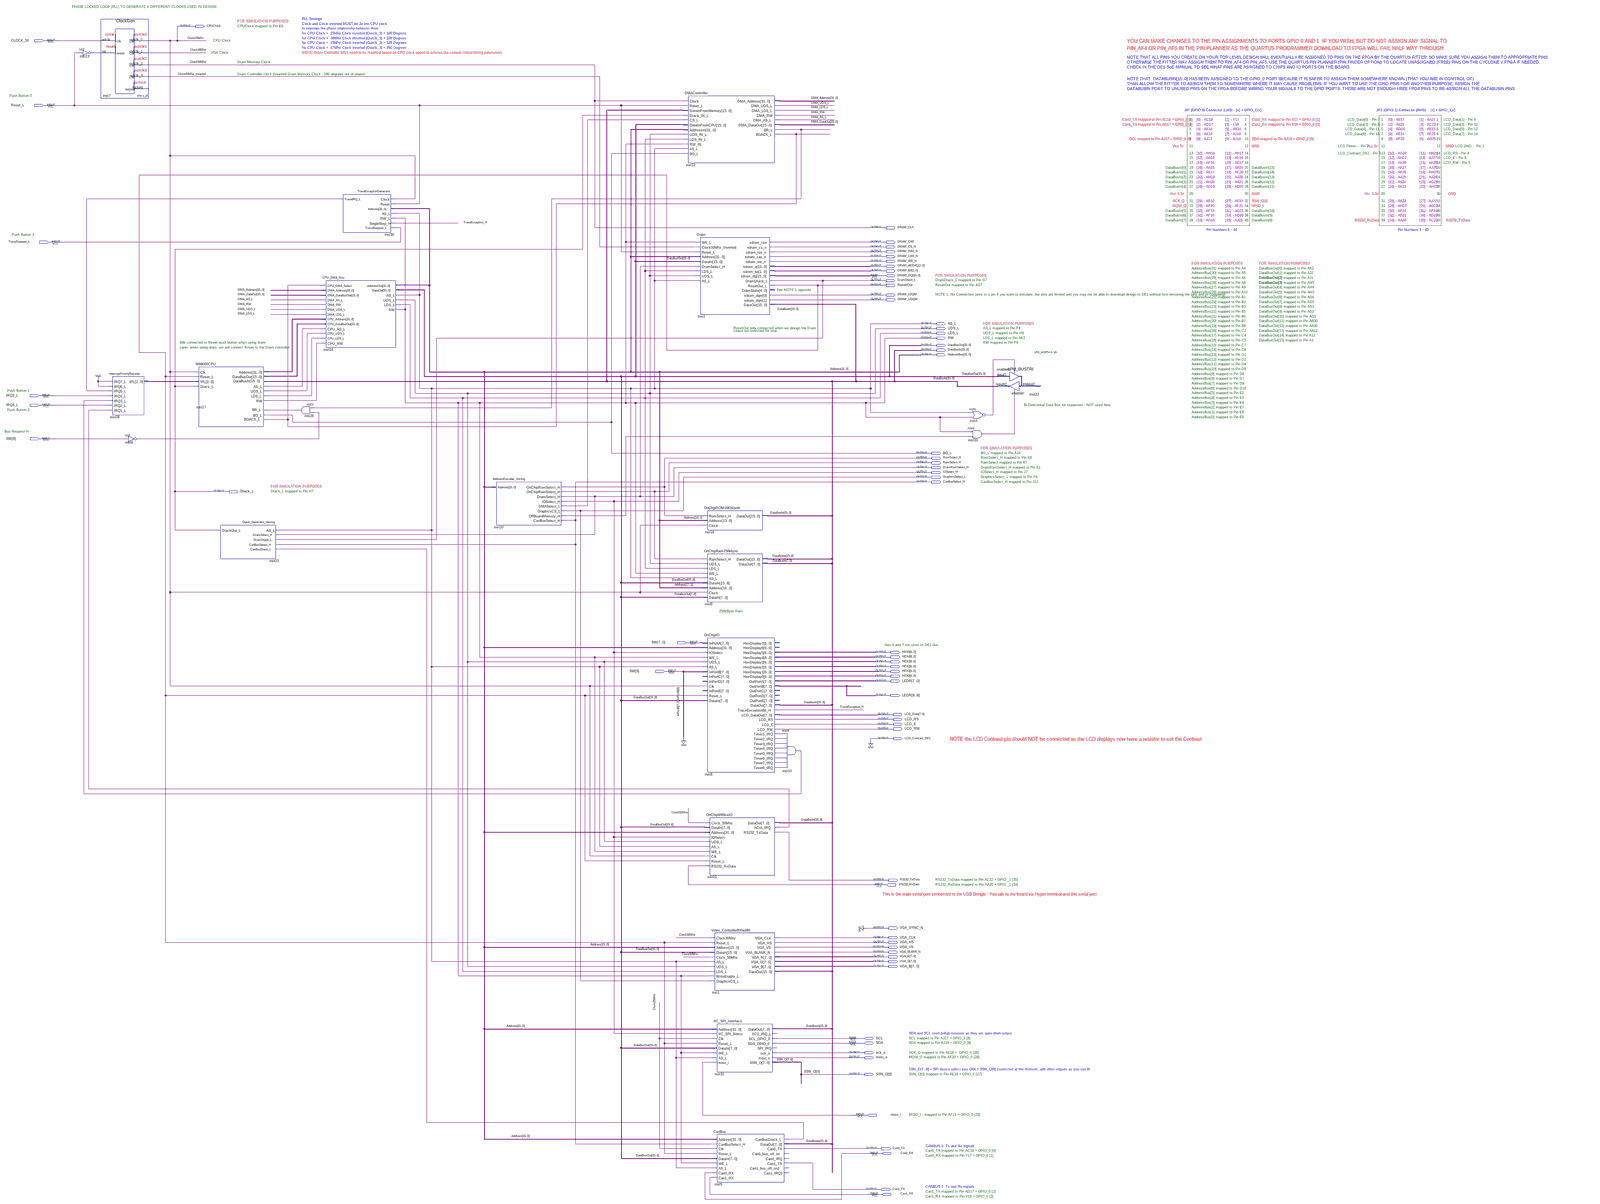
[diagram p0: schematic sheet, whole]
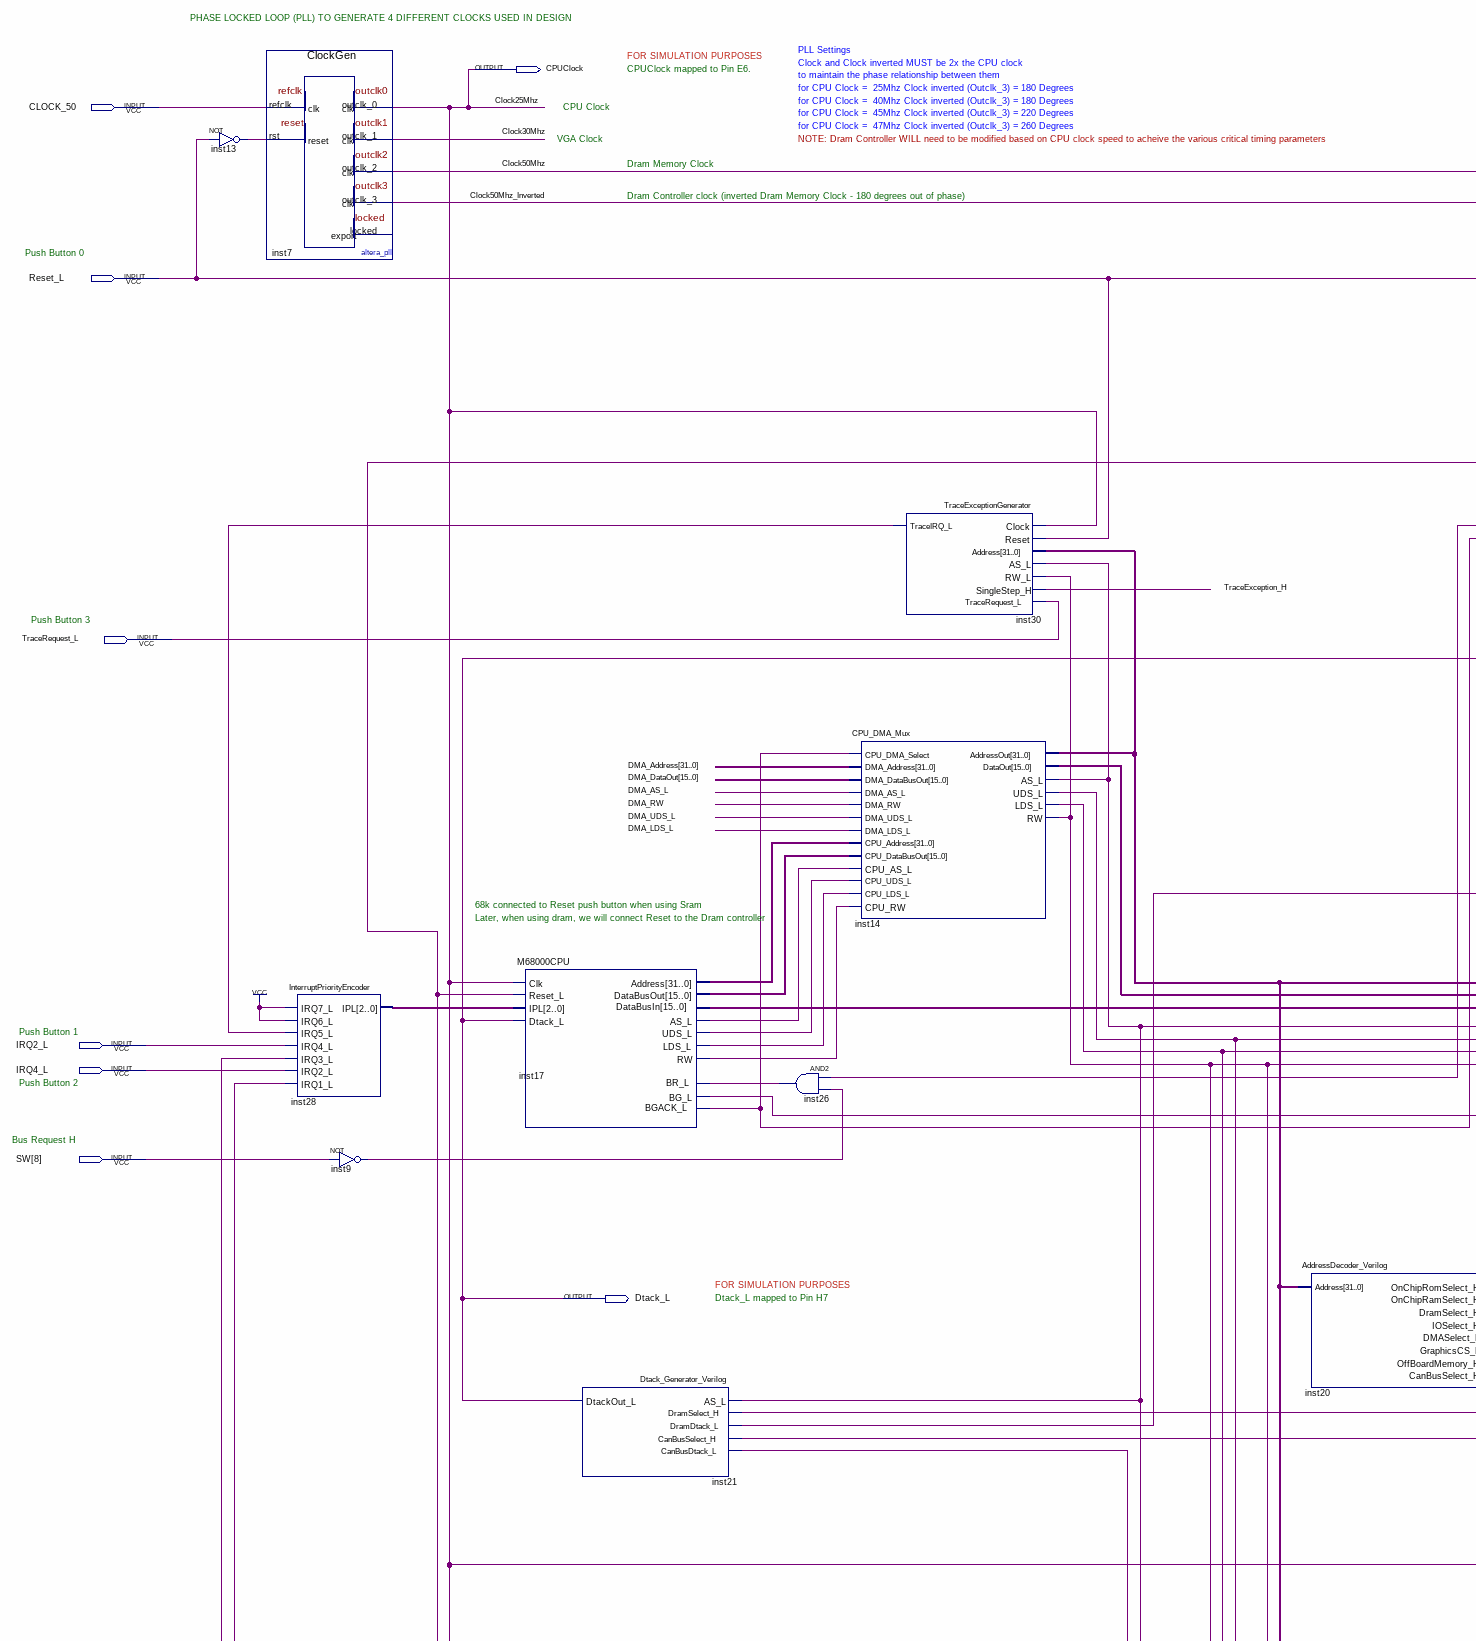
[diagram p1: schematic sheet, upper left part]
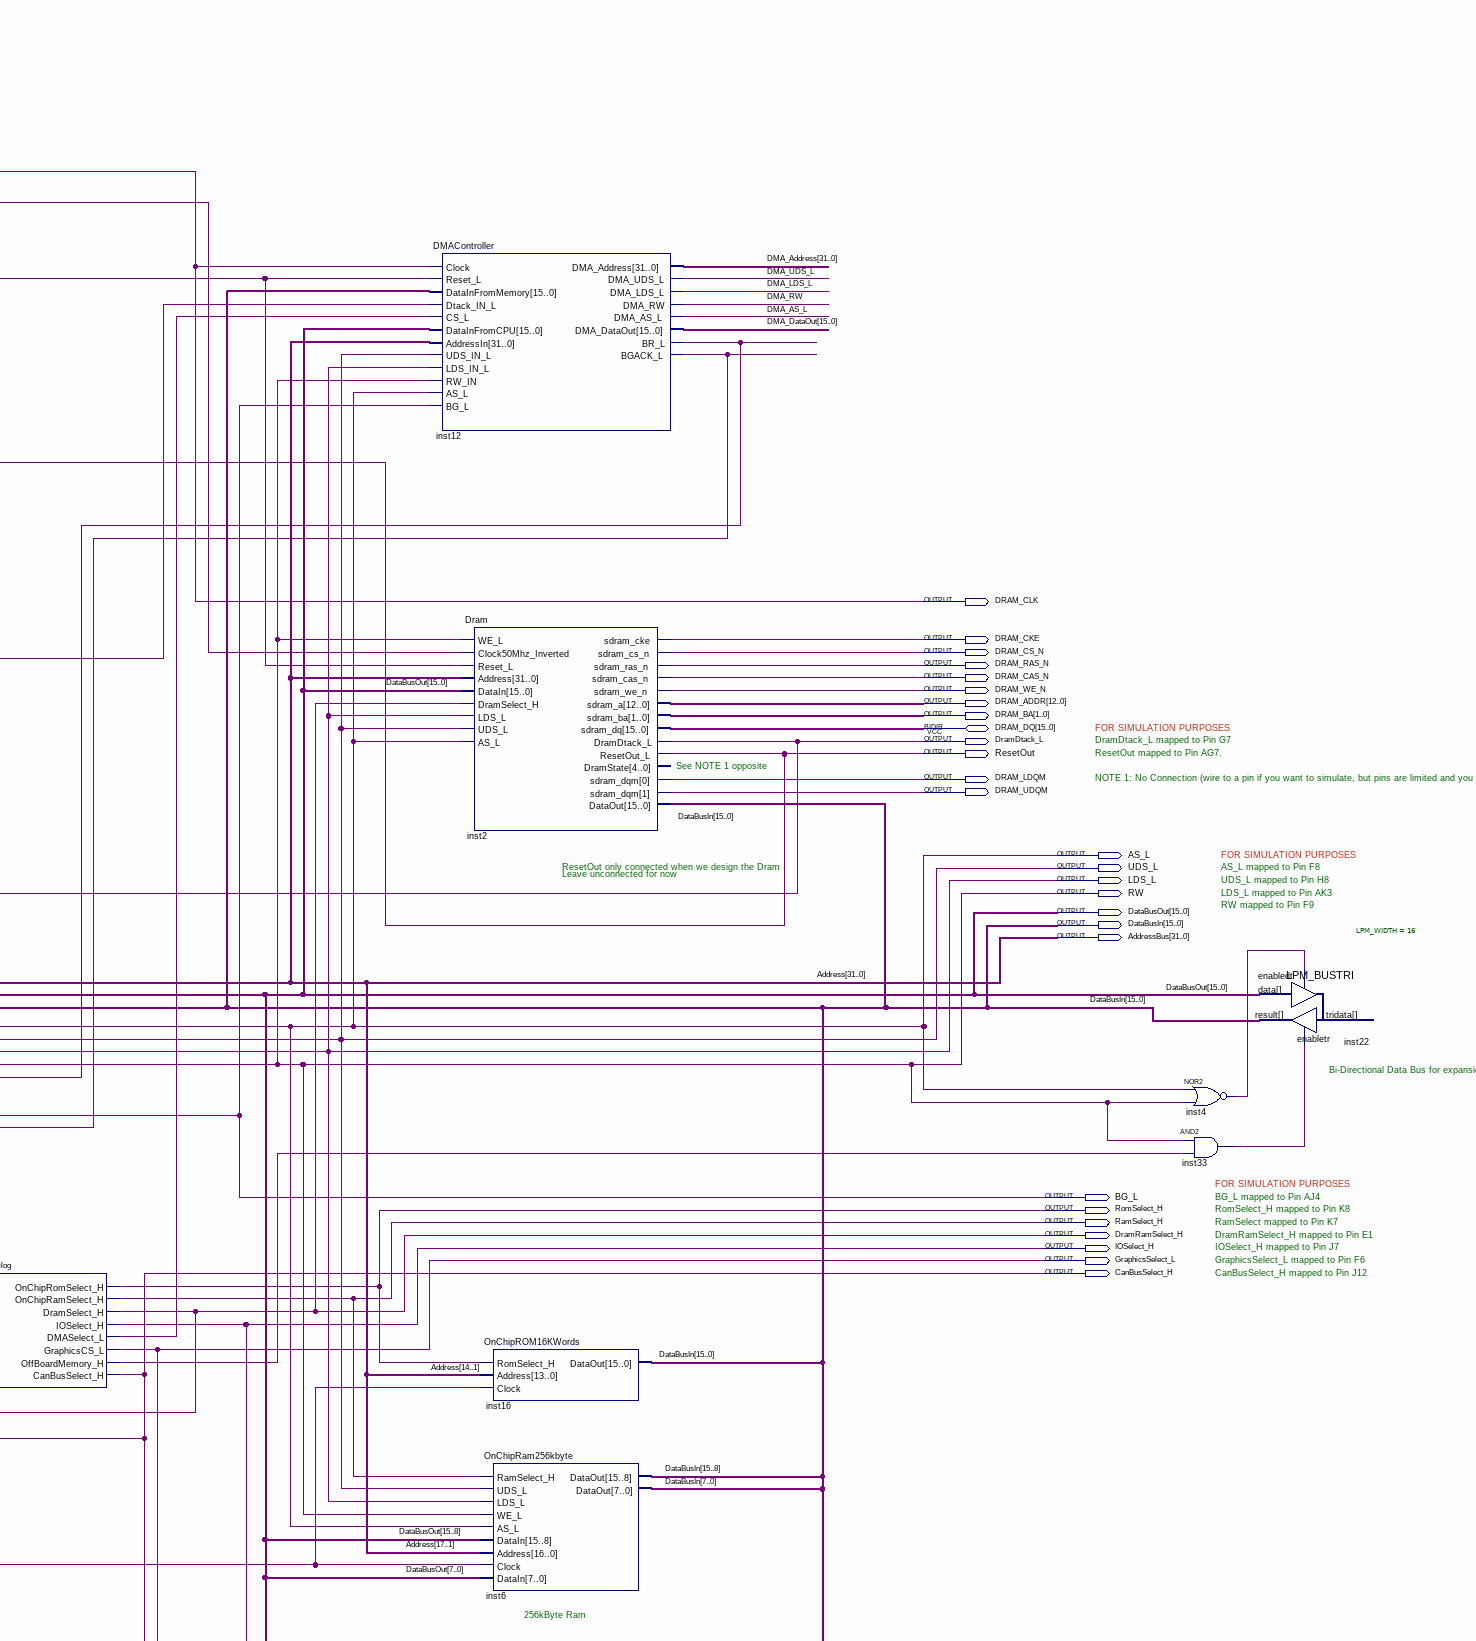
[diagram p2: schematic sheet, upper centre part]
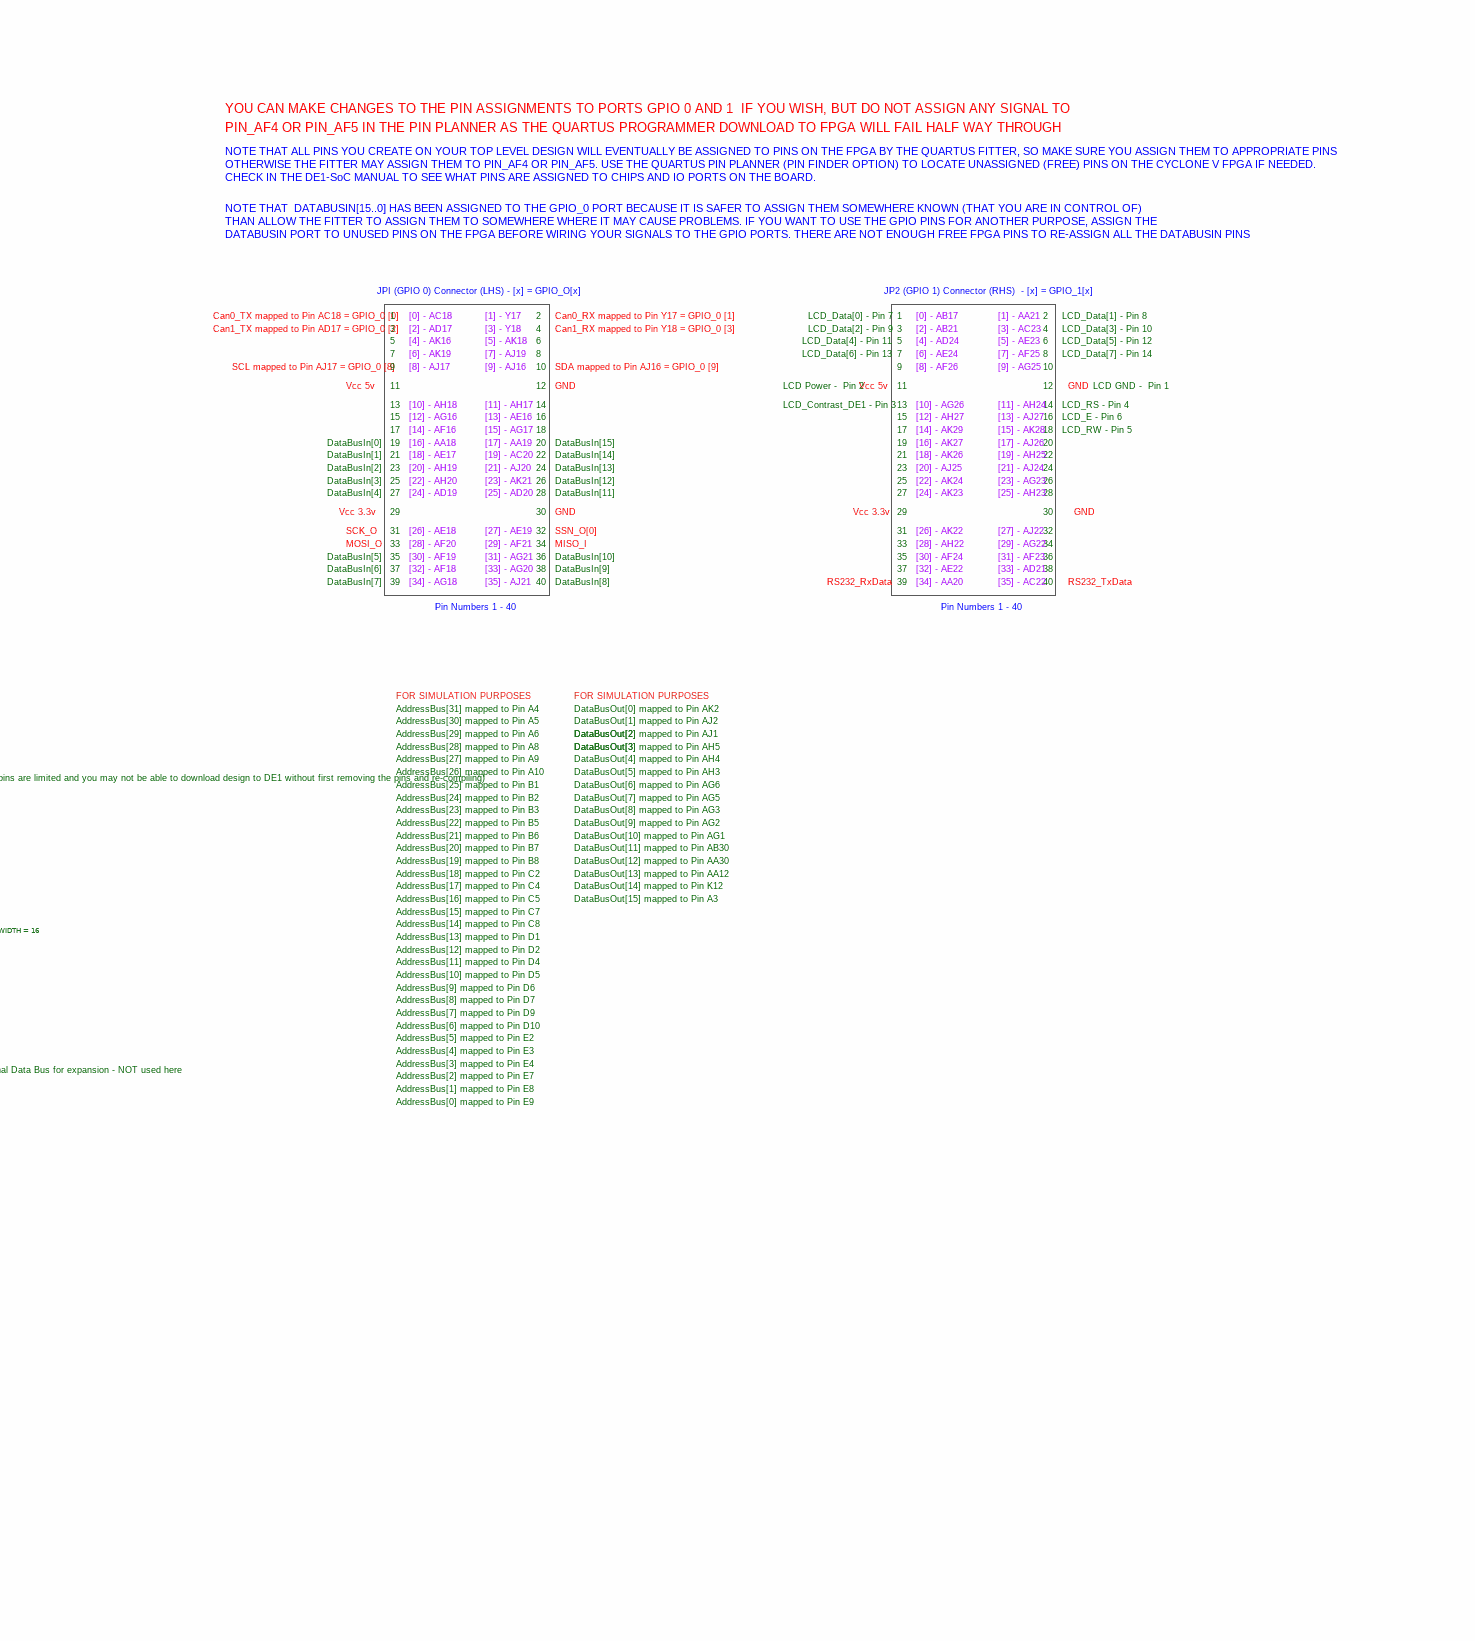
[diagram p3: schematic sheet, upper right part]
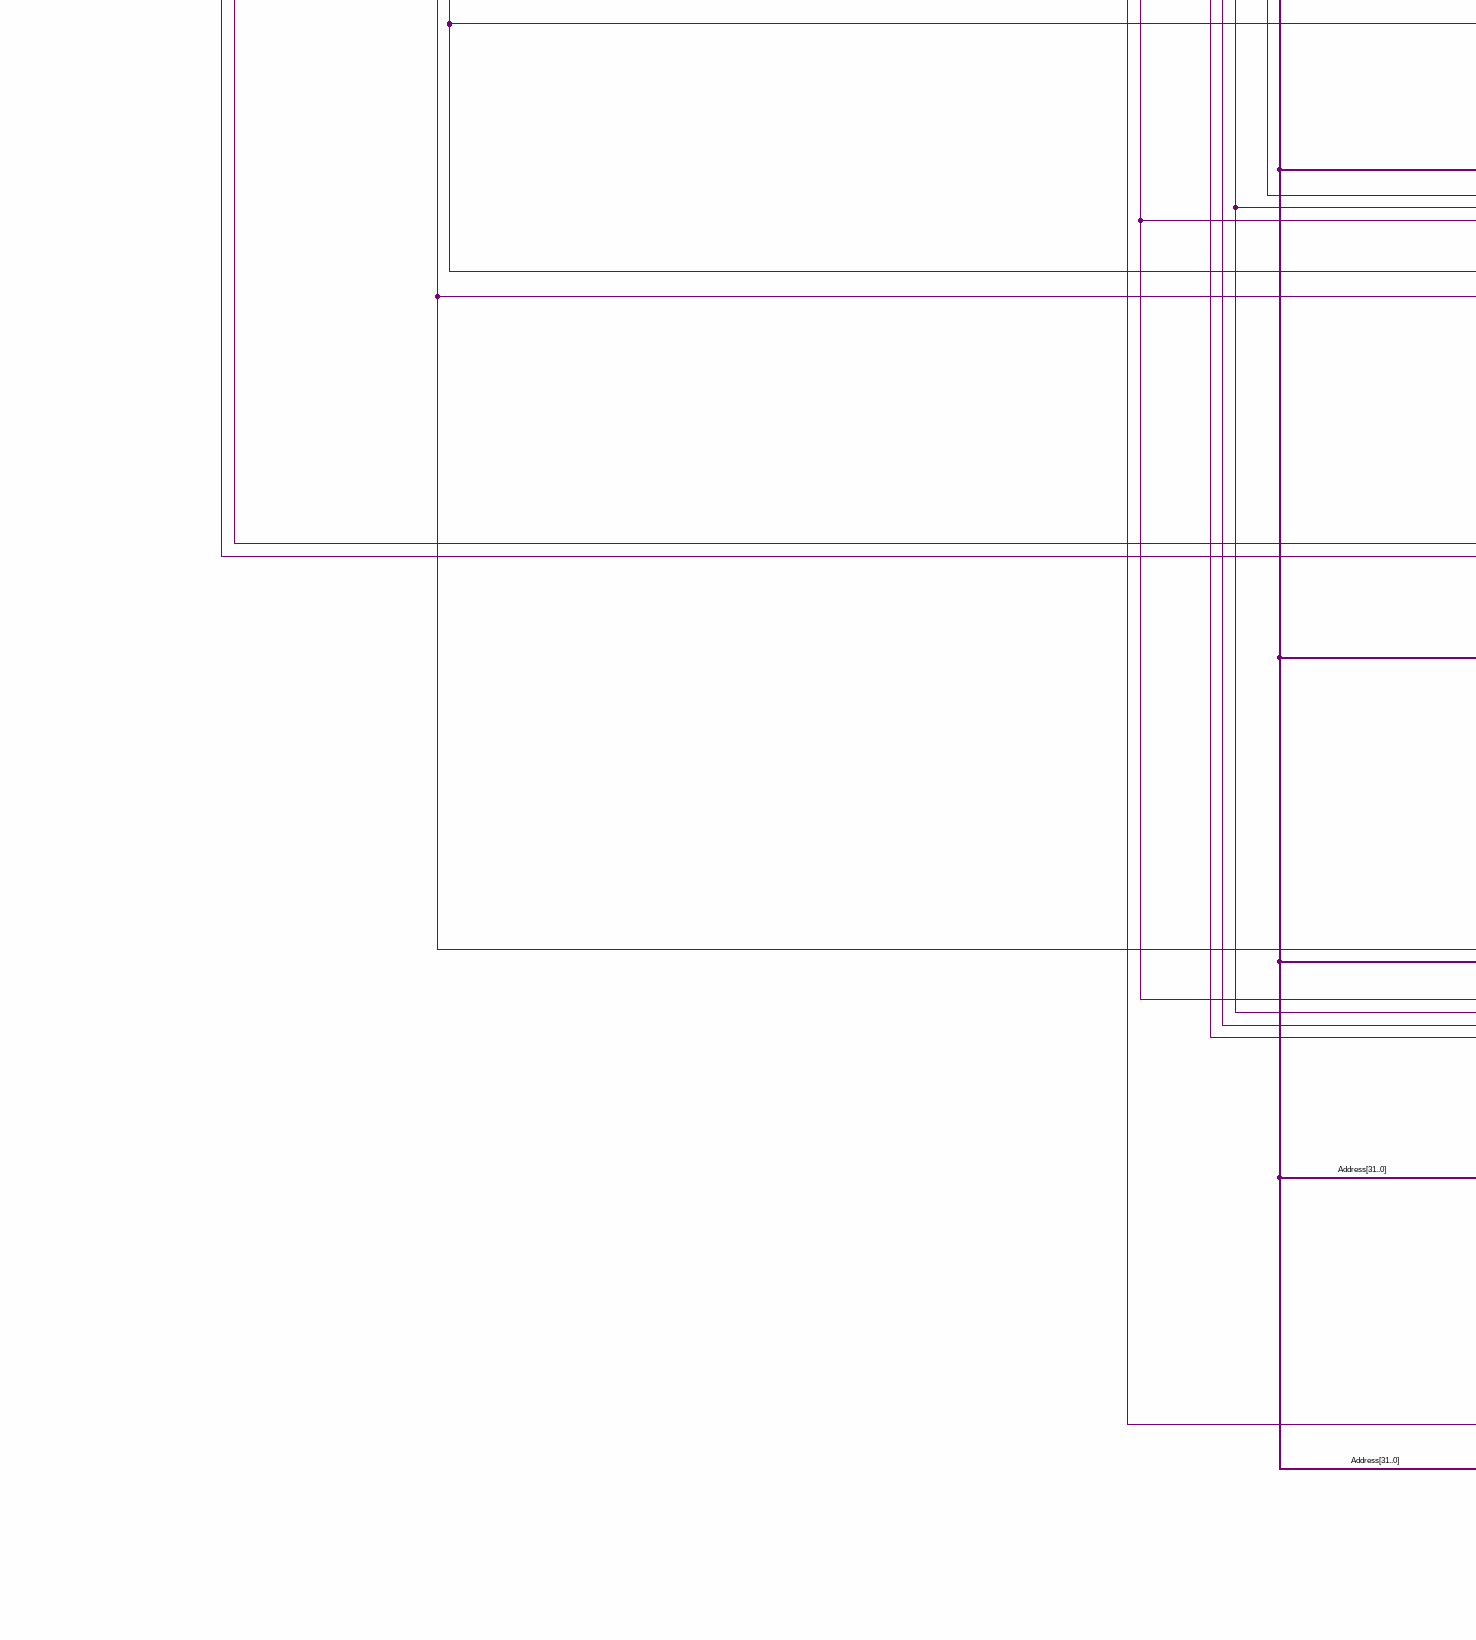
[diagram p4: schematic sheet, lower left part]
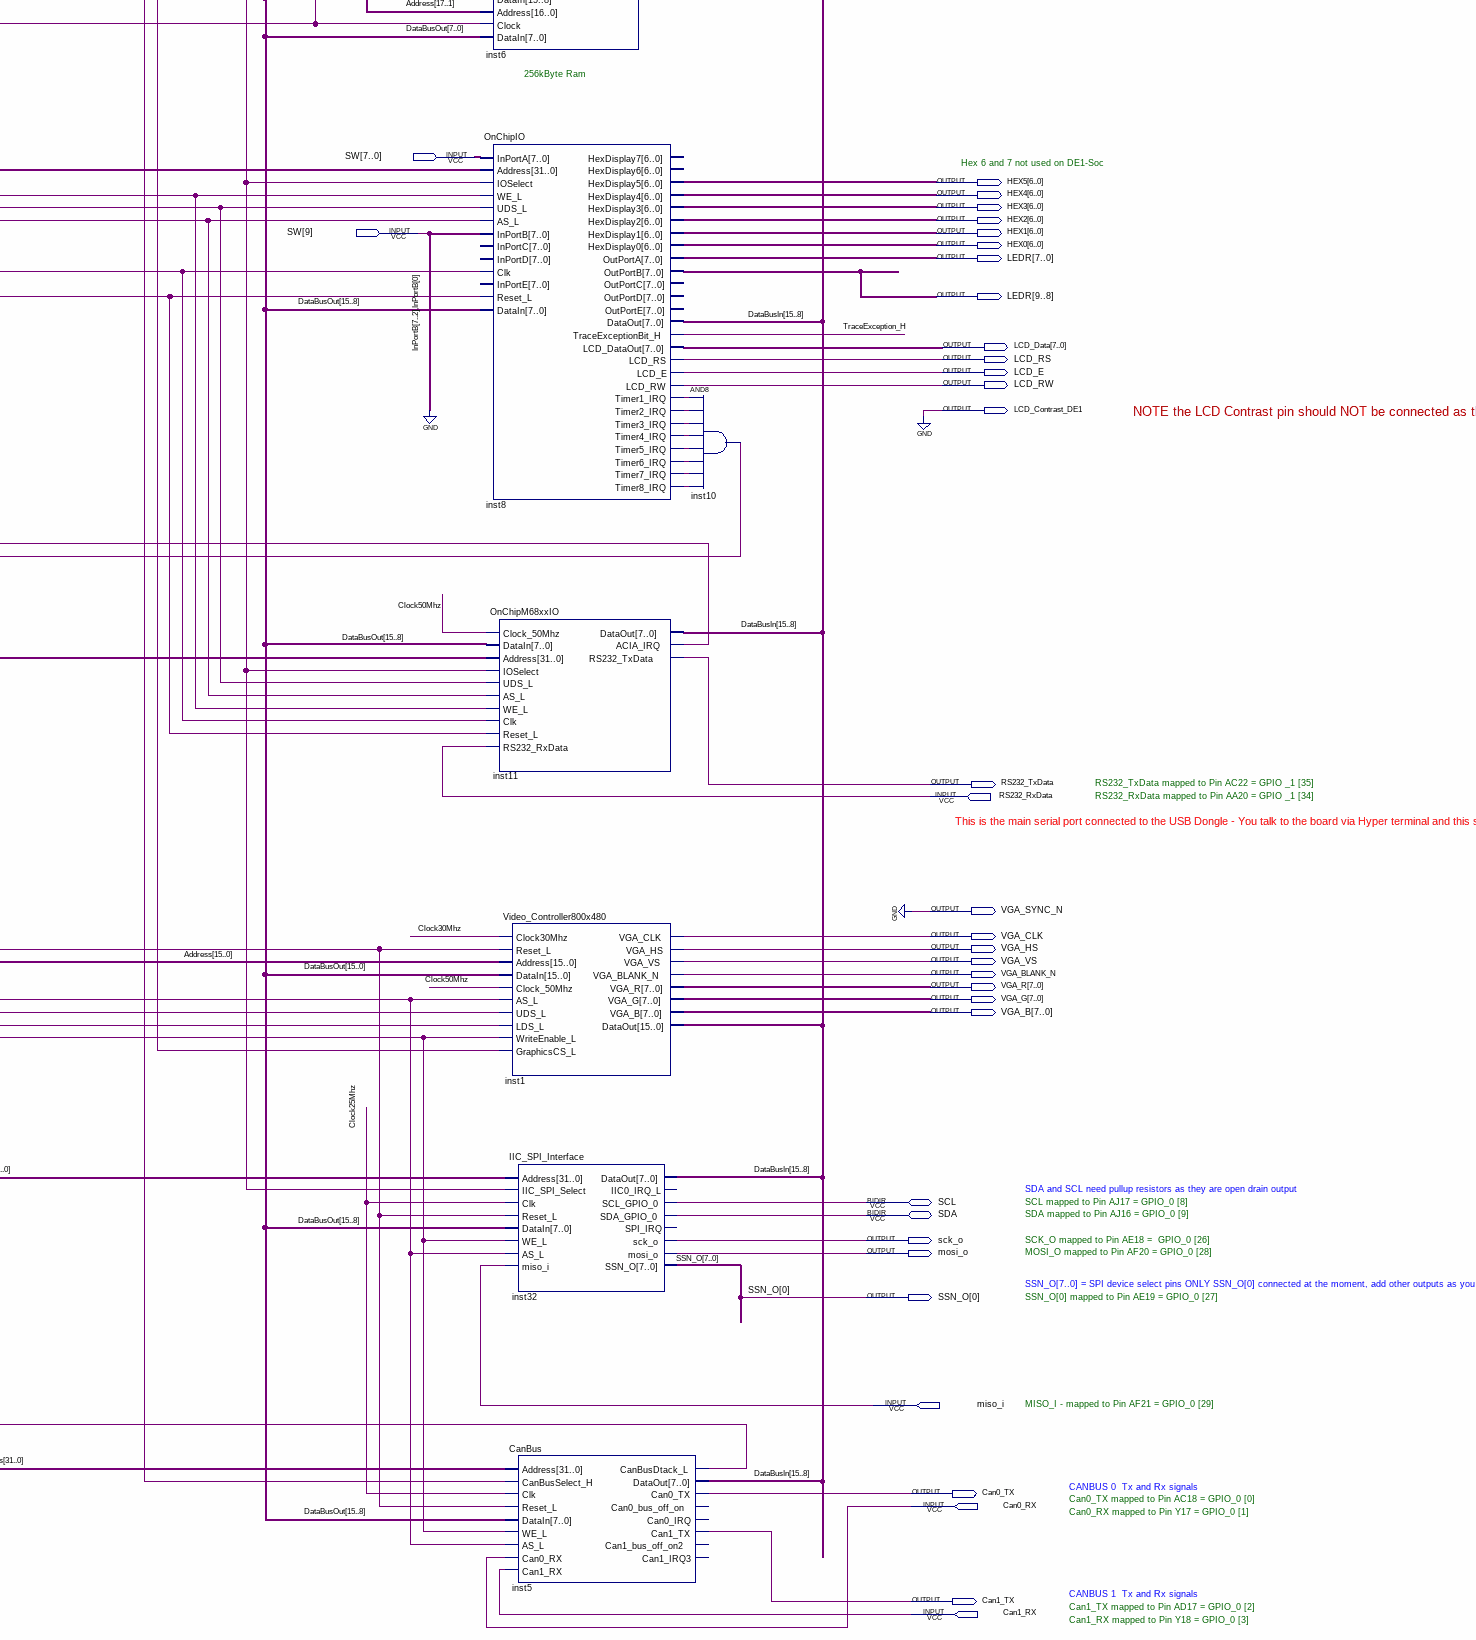
[diagram p5: schematic sheet, lower centre part]
// Quartus schematic MC68K.bdf as structural Verilog: 23 symbols, 70 pins
module MC68K (
  input  CLOCK_50,
  input  Reset_L,
  input  TraceRequest_L,
  input  IRQ2_L,
  input  IRQ4_L,
  input  [9:0] SW,
  input  RS232_RxData,
  input  miso_i,
  input  Can0_RX,
  input  Can1_RX,
  inout  [15:0] DRAM_DQ,
  inout  SCL,
  inout  SDA,
  output CPUClock,
  output DRAM_CLK,
  output DRAM_CKE,
  output DRAM_CS_N,
  output DRAM_RAS_N,
  output DRAM_CAS_N,
  output DRAM_WE_N,
  output [12:0] DRAM_ADDR,
  output [1:0] DRAM_BA,
  output DramDtack_L,
  output ResetOut,
  output DRAM_LDQM,
  output DRAM_UDQM,
  output AS_L,
  output UDS_L,
  output LDS_L,
  output RW,
  output [15:0] DataBusOut,
  output [15:0] DataBusIn,
  output [31:0] AddressBus,
  output BG_L,
  output RomSelect_H,
  output RamSelect_H,
  output DramRamSelect_H,
  output IOSelect_H,
  output GraphicsSelect_L,
  output CanBusSelect_H,
  output Dtack_L,
  output [6:0] HEX5,
  output [6:0] HEX4,
  output [6:0] HEX3,
  output [6:0] HEX2,
  output [6:0] HEX1,
  output [6:0] HEX0,
  output [9:0] LEDR,
  output [7:0] LCD_Data,
  output LCD_RS,
  output LCD_E,
  output LCD_RW,
  output LCD_Contrast_DE1,
  output RS232_TxData,
  output VGA_SYNC_N,
  output VGA_CLK,
  output VGA_HS,
  output VGA_VS,
  output VGA_BLANK_N,
  output [7:0] VGA_R,
  output [7:0] VGA_G,
  output [7:0] VGA_B,
  output sck_o,
  output mosi_o,
  output [7:0] SSN_O,
  output Can0_TX,
  output Can1_TX
);

  wire Clock30Mhz, Clock50Mhz_Inverted, DMA_AS_L, DMA_LDS_L, DMA_RW, DMA_UDS_L, inst4_out,
       inst5_canbusdtack_l, inst8_timer1_irq, inst8_timer2_irq, inst8_timer3_irq, inst8_timer4_irq,
       inst8_timer5_irq, inst8_timer6_irq, inst8_timer7_irq, inst8_timer8_irq, inst9_out, inst10_out,
       inst11_acia_irq, inst12_bgack_l, inst12_br_l, inst13_out, inst17_as_l, inst17_lds_l, inst17_rw,
       inst17_uds_l, inst20_dmaselect_l, inst20_offboardmemory_h, inst26_out, inst30_traceirq_l, inst33_out,
       TraceException_H;
  wire [2:0] inst28_ipl;
  wire [7:2] OutPortB;
  wire [15:0] DMA_DataOut, inst17_databusout;
  wire [31:0] DMA_Address, inst17_address;

  not inst13 (inst13_out, Reset_L);
  ClockGen inst7 (
    .refclk(CLOCK_50), .rst(inst13_out), .outclk_0(CPUClock), .outclk_1(Clock30Mhz), .outclk_2(DRAM_CLK),
    .outclk_3(Clock50Mhz_Inverted));  // open: locked
  InterruptPriorityEncoder inst28 (
    .IRQ7_L(1'b1), .IRQ6_L(1'b1), .IRQ5_L(inst30_traceirq_l), .IRQ4_L(IRQ2_L), .IRQ3_L(inst10_out),
    .IRQ2_L(IRQ4_L), .IRQ1_L(inst11_acia_irq), .IPL(inst28_ipl));
  not inst9 (inst9_out, SW[8]);
  M68000CPU inst17 (
    .DataBusIn(DataBusIn), .Clk(CPUClock), .Reset_L(ResetOut), .IPL(inst28_ipl), .Dtack_L(Dtack_L),
    .BR_L(inst26_out), .BGACK_L(inst12_bgack_l), .Address(inst17_address), .DataBusOut(inst17_databusout),
    .AS_L(inst17_as_l), .UDS_L(inst17_uds_l), .LDS_L(inst17_lds_l), .RW(inst17_rw), .BG_L(BG_L));
  Dtack_Generator_Verilog inst21 (
    .AS_L(AS_L), .DramSelect_H(DramRamSelect_H), .DramDtack_L(DramDtack_L), .CanBusSelect_H(CanBusSelect_H),
    .CanBusDtack_L(inst5_canbusdtack_l), .DtackOut_L(Dtack_L));
  and inst26 (inst26_out, inst12_br_l, inst9_out);
  CPU_DMA_Mux inst14 (
    .CPU_DMA_Select(inst12_bgack_l), .DMA_Address(DMA_Address), .DMA_DataBusOut(DMA_DataOut),
    .DMA_AS_L(DMA_AS_L), .DMA_RW(DMA_RW), .DMA_UDS_L(DMA_UDS_L), .DMA_LDS_L(DMA_LDS_L),
    .CPU_Address(inst17_address), .CPU_DataBusOut(inst17_databusout), .CPU_AS_L(inst17_as_l),
    .CPU_UDS_L(inst17_uds_l), .CPU_LDS_L(inst17_lds_l), .CPU_RW(inst17_rw), .AddressOut(AddressBus),
    .DataOut(DataBusOut), .AS_L(AS_L), .UDS_L(UDS_L), .LDS_L(LDS_L), .RW(RW));
  TraceExceptionGenerator inst30 (
    .Clock(CPUClock), .Reset(Reset_L), .Address(AddressBus), .AS_L(AS_L), .RW_L(RW),
    .SingleStep_H(TraceException_H), .TraceRequest_L(TraceRequest_L), .TraceIRQ_L(inst30_traceirq_l));
  AddressDecoder_Verilog inst20 (
    .Address(AddressBus), .OnChipRomSelect_H(RomSelect_H), .OnChipRamSelect_H(RamSelect_H),
    .DramSelect_H(DramRamSelect_H), .IOSelect_H(IOSelect_H), .DMASelect_L(inst20_dmaselect_l),
    .GraphicsCS_L(GraphicsSelect_L), .OffBoardMemory_H(inst20_offboardmemory_h),
    .CanBusSelect_H(CanBusSelect_H));
  DMAController inst12 (
    .Clock(DRAM_CLK), .Reset_L(Reset_L), .DataInFromMemory(DataBusIn), .Dtack_IN_L(Dtack_L),
    .CS_L(inst20_dmaselect_l), .DataInFromCPU(DataBusOut), .AddressIn(AddressBus), .UDS_IN_L(UDS_L),
    .LDS_IN_L(LDS_L), .RW_IN(RW), .AS_L(AS_L), .BG_L(BG_L), .DMA_Address(DMA_Address), .DMA_UDS_L(DMA_UDS_L),
    .DMA_LDS_L(DMA_LDS_L), .DMA_RW(DMA_RW), .DMA_AS_L(DMA_AS_L), .DMA_DataOut(DMA_DataOut),
    .BR_L(inst12_br_l), .BGACK_L(inst12_bgack_l));
  Dram inst2 (
    .WE_L(RW), .Clock50Mhz_Inverted(Clock50Mhz_Inverted), .Reset_L(Reset_L), .Address(AddressBus),
    .DataIn(DataBusOut), .DramSelect_H(DramRamSelect_H), .LDS_L(LDS_L), .UDS_L(UDS_L), .AS_L(AS_L),
    .sdram_cke(DRAM_CKE), .sdram_cs_n(DRAM_CS_N), .sdram_ras_n(DRAM_RAS_N), .sdram_cas_n(DRAM_CAS_N),
    .sdram_we_n(DRAM_WE_N), .sdram_a(DRAM_ADDR), .sdram_ba(DRAM_BA), .DramDtack_L(DramDtack_L),
    .ResetOut_L(ResetOut), .sdram_dqm({DRAM_UDQM, DRAM_LDQM}), .DataOut(DataBusIn), .sdram_dq(DRAM_DQ));  // open: DramState
  OnChipROM16KWords inst16 (
    .RomSelect_H(RomSelect_H), .Address(AddressBus[14:1]), .Clock(CPUClock), .DataOut(DataBusIn));
  OnChipRam256kbyte inst6 (
    .RamSelect_H(RamSelect_H), .UDS_L(UDS_L), .LDS_L(LDS_L), .WE_L(RW), .AS_L(AS_L), .DataIn(DataBusOut),
    .Address(AddressBus[17:1]), .Clock(CPUClock), .DataOut(DataBusIn));
  OnChipIO inst8 (
    .InPortA(SW[7:0]), .Address(AddressBus), .IOSelect(IOSelect_H), .WE_L(RW), .UDS_L(UDS_L), .AS_L(AS_L),
    .InPortB({{6{1'b0}}, SW[9], 1'b0}), .Clk(CPUClock), .Reset_L(ResetOut), .DataIn(DataBusOut[15:8]),
    .HexDisplay5(HEX5), .HexDisplay4(HEX4), .HexDisplay3(HEX3), .HexDisplay2(HEX2), .HexDisplay1(HEX1),
    .HexDisplay0(HEX0), .OutPortA(LEDR[7:0]), .OutPortB({OutPortB, LEDR[9:8]}), .DataOut(DataBusIn[15:8]),
    .TraceExceptionBit_H(TraceException_H), .LCD_DataOut(LCD_Data), .LCD_RS(LCD_RS), .LCD_E(LCD_E),
    .LCD_RW(LCD_RW), .Timer1_IRQ(inst8_timer1_irq), .Timer2_IRQ(inst8_timer2_irq),
    .Timer3_IRQ(inst8_timer3_irq), .Timer4_IRQ(inst8_timer4_irq), .Timer5_IRQ(inst8_timer5_irq),
    .Timer6_IRQ(inst8_timer6_irq), .Timer7_IRQ(inst8_timer7_irq), .Timer8_IRQ(inst8_timer8_irq));  // open: InPortC, InPortD, InPortE, HexDisplay7, HexDisplay6, OutPortC, OutPortD, OutPortE
  OnChipM68xxIO inst11 (
    .Clock_50Mhz(DRAM_CLK), .DataIn(DataBusOut[15:8]), .Address(AddressBus), .IOSelect(IOSelect_H),
    .UDS_L(UDS_L), .AS_L(AS_L), .WE_L(RW), .Clk(CPUClock), .Reset_L(ResetOut), .RS232_RxData(RS232_RxData),
    .DataOut(DataBusIn[15:8]), .ACIA_IRQ(inst11_acia_irq), .RS232_TxData(RS232_TxData));
  Video_Controller800x480 inst1 (
    .Clock30Mhz(Clock30Mhz), .Reset_L(ResetOut), .Address(AddressBus[15:0]), .DataIn(DataBusOut),
    .Clock_50Mhz(DRAM_CLK), .AS_L(AS_L), .UDS_L(UDS_L), .LDS_L(LDS_L), .WriteEnable_L(RW),
    .GraphicsCS_L(GraphicsSelect_L), .VGA_CLK(VGA_CLK), .VGA_HS(VGA_HS), .VGA_VS(VGA_VS),
    .VGA_BLANK_N(VGA_BLANK_N), .VGA_R(VGA_R), .VGA_G(VGA_G), .VGA_B(VGA_B), .DataOut(DataBusIn));
  IIC_SPI_Interface inst32 (
    .Address(AddressBus), .IIC_SPI_Select(IOSelect_H), .Clk(CPUClock), .Reset_L(ResetOut),
    .DataIn(DataBusOut[15:8]), .WE_L(RW), .AS_L(AS_L), .miso_i(miso_i), .DataOut(DataBusIn[15:8]),
    .sck_o(sck_o), .mosi_o(mosi_o), .SSN_O(SSN_O), .SCL_GPIO_0(SCL), .SDA_GPIO_0(SDA));  // open: IIC0_IRQ_L, SPI_IRQ
  CanBus inst5 (
    .Address(AddressBus), .CanBusSelect_H(CanBusSelect_H), .Clk(CPUClock), .Reset_L(ResetOut),
    .DataIn(DataBusOut[15:8]), .WE_L(RW), .AS_L(AS_L), .Can0_RX(Can0_RX), .Can1_RX(Can1_RX),
    .CanBusDtack_L(inst5_canbusdtack_l), .DataOut(DataBusIn[15:8]), .Can0_TX(Can0_TX), .Can1_TX(Can1_TX));  // open: Can0_bus_off_on, Can0_IRQ, Can1_bus_off_on2, Can1_IRQ3
  and inst10 (inst10_out, inst8_timer1_irq, inst8_timer2_irq, inst8_timer3_irq, inst8_timer4_irq, inst8_timer5_irq, inst8_timer6_irq, inst8_timer7_irq, inst8_timer8_irq);
  nor inst4 (inst4_out, AS_L, RW);
  and inst33 (inst33_out, RW, inst20_offboardmemory_h);
  LPM_BUSTRI #(.LPM_WIDTH(16)) inst22 (
    .data(DataBusOut), .enabledt(inst4_out), .enabletr(inst33_out), .result(DataBusIn));  // open: tridata

  assign LCD_Contrast_DE1 = 1'b0;
  assign VGA_SYNC_N = 1'b0;

  // Other names for the same wires on the sheet: Address[31:0] = AddressBus; Clock50Mhz = DRAM_CLK;
  //   Clock25Mhz = CPUClock; InPortA[7:0] = SW[7:0]; InPortB[1] = SW[9]; OutPortB[1:0] = LEDR[9:8]

  // Notes on the sheet:
  //   PHASE LOCKED LOOP (PLL) TO GENERATE 4 DIFFERENT CLOCKS USED IN DESIGN
  //   PLL Settings
  //   FOR SIMULATION PURPOSES
  //   Clock and Clock inverted MUST be 2x the CPU clock
  //   CPUClock mapped to Pin E6.
  //   to maintain the phase relationship between them
  //   for CPU Clock =  25Mhz Clock inverted (Outclk_3) = 180 Degrees
  //   for CPU Clock =  40Mhz Clock inverted (Outclk_3) = 180 Degrees
  //   CPU Clock
  //   YOU CAN MAKE CHANGES TO THE PIN ASSIGNMENTS TO PORTS GPIO 0 AND 1  IF YOU WISH, BUT DO NOT ASSIGN ANY SIGNAL TO 
  //   for CPU Clock =  45Mhz Clock inverted (Outclk_3) = 220 Degrees
  //   for CPU Clock =  47Mhz Clock inverted (Outclk_3) = 260 Degrees
  //   PIN_AF4 OR PIN_AF5 IN THE PIN PLANNER AS THE QUARTUS PROGRAMMER DOWNLOAD TO FPGA WILL FAIL HALF WAY THROUGH
  //   VGA Clock
  //   NOTE: Dram Controller WILL need to be modified based on CPU clock speed to acheive the various critical timing parameters
  //   NOTE THAT ALL PINS YOU CREATE ON YOUR TOP LEVEL DESIGN WILL EVENTUALLY BE ASSIGNED TO PINS ON THE FPGA BY THE QUARTUS FITTER, SO MAKE SURE YOU ASSIGN THEM TO APPROPRIATE PINS
  //   Dram Memory Clock
  //   OTHERWISE THE FITTER MAY ASSIGN THEM TO PIN_AF4 OR PIN_AF5. USE THE QUARTUS PIN PLANNER (PIN FINDER OPTION) TO LOCATE UNASSIGNED (FREE) PINS ON THE CYCLONE V FPGA IF NEEDED.
  //   CHECK IN THE DE1-SoC MANUAL TO SEE WHAT PINS ARE ASSIGNED TO CHIPS AND IO PORTS ON THE BOARD. 
  //   Dram Controller clock (inverted Dram Memory Clock - 180 degrees out of phase)
  //   NOTE THAT  DATABUSIN[15..0] HAS BEEN ASSIGNED TO THE GPIO_0 PORT BECAUSE IT IS SAFER TO ASSIGN THEM SOMEWHERE KNOWN (THAT YOU ARE IN CONTROL OF) 
  //   THAN ALLOW THE FITTER TO ASSIGN THEM TO SOMEWHERE WHERE IT MAY CAUSE PROBLEMS. IF YOU WANT TO USE THE GPIO PINS FOR ANOTHER PURPOSE, ASSIGN THE 
  //   DATABUSIN PORT TO UNUSED PINS ON THE FPGA BEFORE WIRING YOUR SIGNALS TO THE GPIO PORTS. THERE ARE NOT ENOUGH FREE FPGA PINS TO RE-ASSIGN ALL THE DATABUSIN PINS
  //   Push Button 0
  //   JPI (GPIO 0) Connector (LHS) - [x] = GPIO_O[x]
  //   JP2 (GPIO 1) Connector (RHS)  - [x] = GPIO_1[x]
  //   Can0_TX mapped to Pin AC18 = GPIO_0 [0]
  //   1
  //   [0] - AC18
  //   [1] - Y17
  //   2
  //   Can0_RX mapped to Pin Y17 = GPIO_0 [1]
  //   LCD_Data[0] - Pin 7
  //   1
  //   [0] - AB17
  //   [1] - AA21
  //   2
  //   LCD_Data[1] - Pin 8
  //   Can1_TX mapped to Pin AD17 = GPIO_0 [2] 
  //   3
  //   [2] - AD17
  //   [3] - Y18
  //   4
  //   Can1_RX mapped to Pin Y18 = GPIO_0 [3]
  //   LCD_Data[2] - Pin 9
  //   3
  //   [2] - AB21
  //   [3] - AC23
  //   4
  //   LCD_Data[3] - Pin 10
  //   5
  //   [4] - AK16
  //   [5] - AK18
  //   6
  //   LCD_Data[4] - Pin 11
  //   5
  //   [4] - AD24
  //   [5] - AE23
  //   6
  //   LCD_Data[5] - Pin 12
  //   7
  //   [6] - AK19
  //   [7] - AJ19
  //   8
  //   LCD_Data[6] - Pin 13
  //   7
  //   [6] - AE24
  //   [7] - AF25
  //   8
  //   LCD_Data[7] - Pin 14
  //   SCL mapped to Pin AJ17 = GPIO_0 [8] 
  //   9
  //   [8] - AJ17
  //   [9] - AJ16
  //   10
  //   SDA mapped to Pin AJ16 = GPIO_0 [9]
  //   9
  //   [8] - AF26
  //   [9] - AG25
  //   10
  //   Vcc 5v
  //   11
  //   12
  //   GND
  //   LCD Power -  Pin 2
  //   Vcc 5v
  //   11
  //   12
  //   GND
  //   LCD GND -  Pin 1
  //   13
  //   [10] - AH18
  //   [11] - AH17
  //   14
  //   LCD_Contrast_DE1 - Pin 3
  //   13
  //   [10] - AG26
  //   [11] - AH24
  //   14
  //   LCD_RS - Pin 4
  //   15
  //   [12] - AG16
  //   [13] - AE16
  //   16
  //   15
  //   [12] - AH27
  //   [13] - AJ27
  //   16
  //   LCD_E - Pin 6
  //   17
  //   [14] - AF16
  //   [15] - AG17
  //   18
  //   17
  //   [14] - AK29
  //   [15] - AK28
  //   18
  //   LCD_RW - Pin 5
  //   DataBusIn[0]
  //   19
  //   [16] - AA18
  //   [17] - AA19
  //   20
  //   DataBusIn[15]
  //   19
  //   [16] - AK27
  //   [17] - AJ26
  //   20
  //   DataBusIn[1]
  //   21
  //   [18] - AE17
  //   [19] - AC20
  //   22
  //   DataBusIn[14]
  //   21
  //   [18] - AK26
  //   [19] - AH25
  //   22
  //   DataBusIn[2]
  //   23
  //   [20] - AH19
  //   [21] - AJ20
  //   24
  //   DataBusIn[13]
  //   23
  //   [20] - AJ25
  //   [21] - AJ24
  //   24
  //   DataBusIn[3]
  //   25
  //   [22] - AH20
  //   [23] - AK21
  //   26
  //   DataBusIn[12]
  //   25
  //   [22] - AK24
  //   [23] - AG23
  //   26
  //   DataBusIn[4]
  //   27
  //   [24] - AD19
  //   [25] - AD20
  //   28
  //   DataBusIn[11]
  //   27
  //   [24] - AK23
  //   [25] - AH23
  //   28
  //   Vcc 3.3v
  //   29
  //   30
  //   GND
  //   Vcc 3.3v
  //   29
  //   30
  //   GND
  //   SCK_O
  //   31
  //   [26] - AE18
  //   [27] - AE19
  //   32
  //   SSN_O[0]
  //   31
  //   [26] - AK22
  //   [27] - AJ22
  //   32
  //   MOSI_O
  //   33
  //   [28] - AF20
  //   [29] - AF21
  //   34
  //   MISO_I
  //   33
  //   [28] - AH22
  //   [29] - AG22
  //   34
  //   DataBusIn[5]
  //   35
  //   [30] - AF19
  //   [31] - AG21
  //   36
  //   DataBusIn[10]
  //   35
  //   [30] - AF24
  //   [31] - AF23
  //   36
  //   DataBusIn[6]
  //   37
  //   [32] - AF18
  //   [33] - AG20
  //   38
  //   DataBusIn[9]
  //   37
  //   [32] - AE22
  //   [33] - AD21
  //   38
  //   DataBusIn[7]
  //   39
  //   [34] - AG18
  //   [35] - AJ21
  //   40
  //   DataBusIn[8]
  //   RS232_RxData
  //   39
  //   [34] - AA20
  //   [35] - AC22
  //   40
  //   RS232_TxData
  //   Pin Numbers 1 - 40
  //   Pin Numbers 1 - 40
  //   Push Button 3
  //   FOR SIMULATION PURPOSES
  //   FOR SIMULATION PURPOSES
  //   AddressBus[31] mapped to Pin A4
  //   DataBusOut[0] mapped to Pin AK2
  //   AddressBus[30] mapped to Pin A5
  //   DataBusOut[1] mapped to Pin AJ2
  //   FOR SIMULATION PURPOSES
  //   AddressBus[29] mapped to Pin A6
  //   DataBusOut[2]
  //   DataBusOut[2] mapped to Pin AJ1
  //   DramDtack_L mapped to Pin G7
  //   AddressBus[28] mapped to Pin A8
  //   DataBusOut[3]
  //   DataBusOut[3] mapped to Pin AH5
  //   ResetOut mapped to Pin AG7.
  //   AddressBus[27] mapped to Pin A9
  //   DataBusOut[4] mapped to Pin AH4
  //   See NOTE 1 opposite
  //   AddressBus[26] mapped to Pin A10
  //   DataBusOut[5] mapped to Pin AH3
  //   NOTE 1: No Connection (wire to a pin if you want to simulate, but pins are limited and you may not be able to download design to DE1 without first removing the pins and re-compiling)
  //   AddressBus[25] mapped to Pin B1
  //   DataBusOut[6] mapped to Pin AG6
  //   AddressBus[24] mapped to Pin B2
  //   DataBusOut[7] mapped to Pin AG5
  //   AddressBus[23] mapped to Pin B3
  //   DataBusOut[8] mapped to Pin AG3
  //   AddressBus[22] mapped to Pin B5
  //   DataBusOut[9] mapped to Pin AG2
  //   AddressBus[21] mapped to Pin B6
  //   DataBusOut[10] mapped to Pin AG1
  //   AddressBus[20] mapped to Pin B7
  //   DataBusOut[11] mapped to Pin AB30
  //   FOR SIMULATION PURPOSES
  //   AddressBus[19] mapped to Pin B8
  //   DataBusOut[12] mapped to Pin AA30
  //   ResetOut only connected when we design the Dram
  //   AS_L mapped to Pin F8
  //   Leave unconnected for now
  //   AddressBus[18] mapped to Pin C2
  //   DataBusOut[13] mapped to Pin AA12
  //   UDS_L mapped to Pin H8
  //   AddressBus[17] mapped to Pin C4
  //   DataBusOut[14] mapped to Pin K12
  //   LDS_L mapped to Pin AK3
  //   AddressBus[16] mapped to Pin C5
  //   DataBusOut[15] mapped to Pin A3
  //   68k connected to Reset push button when using Sram
  //   RW mapped to Pin F9
  //   AddressBus[15] mapped to Pin C7
  //   Later, when using dram, we will connect Reset to the Dram controller
  //   AddressBus[14] mapped to Pin C8
  //   AddressBus[13] mapped to Pin D1
  //   AddressBus[12] mapped to Pin D2
  //   AddressBus[11] mapped to Pin D4
  //   AddressBus[10] mapped to Pin D5
  //   AddressBus[9] mapped to Pin D6
  //   AddressBus[8] mapped to Pin D7
  //   AddressBus[7] mapped to Pin D9
  //   AddressBus[6] mapped to Pin D10
  //   Push Button 1
  //   AddressBus[5] mapped to Pin E2
  //   AddressBus[4] mapped to Pin E3
  //   AddressBus[3] mapped to Pin E4
  //   Bi-Directional Data Bus for expansion - NOT used here
  //   AddressBus[2] mapped to Pin E7
  //   Push Button 2
  //   AddressBus[1] mapped to Pin E8
  //   AddressBus[0] mapped to Pin E9
  //   Bus Request H
  //   FOR SIMULATION PURPOSES
  //   BG_L mapped to Pin AJ4
  //   RomSelect_H mapped to Pin K8
  //   RamSelect mapped to Pin K7
  //   DramRamSelect_H mapped to Pin E1
  //   IOSelect_H mapped to Pin J7
  //   GraphicsSelect_L mapped to Pin F6
  //   CanBusSelect_H mapped to Pin J12
  //   FOR SIMULATION PURPOSES
  //   Dtack_L mapped to Pin H7
  //   256kByte Ram
  //   Hex 6 and 7 not used on DE1-Soc
  //   NOTE the LCD Contrast pin should NOT be connected as the LCD displays now have a resistor to set the Contrast
  //   RS232_TxData mapped to Pin AC22 = GPIO _1 [35]
  //   RS232_RxData mapped to Pin AA20 = GPIO _1 [34]
  //   This is the main serial port connected to the USB Dongle - You talk to the board via Hyper terminal and this serial port
  //   SDA and SCL need pullup resistors as they are open drain output
  //   SCL mapped to Pin AJ17 = GPIO_0 [8] 
  //   SDA mapped to Pin AJ16 = GPIO_0 [9]
  //   SCK_O mapped to Pin AE18 =  GPIO_0 [26]
  //   MOSI_O mapped to Pin AF20 = GPIO_0 [28]
  //   SSN_O[7..0] = SPI device select pins ONLY SSN_O[0] connected at the moment, add other outputs as you see fit
  //   SSN_O[0] mapped to Pin AE19 = GPIO_0 [27]
  //   MISO_I - mapped to Pin AF21 = GPIO_0 [29]
  //   CANBUS 0  Tx and Rx signals 
  //   Can0_TX mapped to Pin AC18 = GPIO_0 [0]
  //   Can0_RX mapped to Pin Y17 = GPIO_0 [1]
  //   CANBUS 1  Tx and Rx signals 
  //   Can1_TX mapped to Pin AD17 = GPIO_0 [2] 
  //   Can1_RX mapped to Pin Y18 = GPIO_0 [3]
endmodule
